# Altium schematic sheet Sheet3.SchDoc
size A4
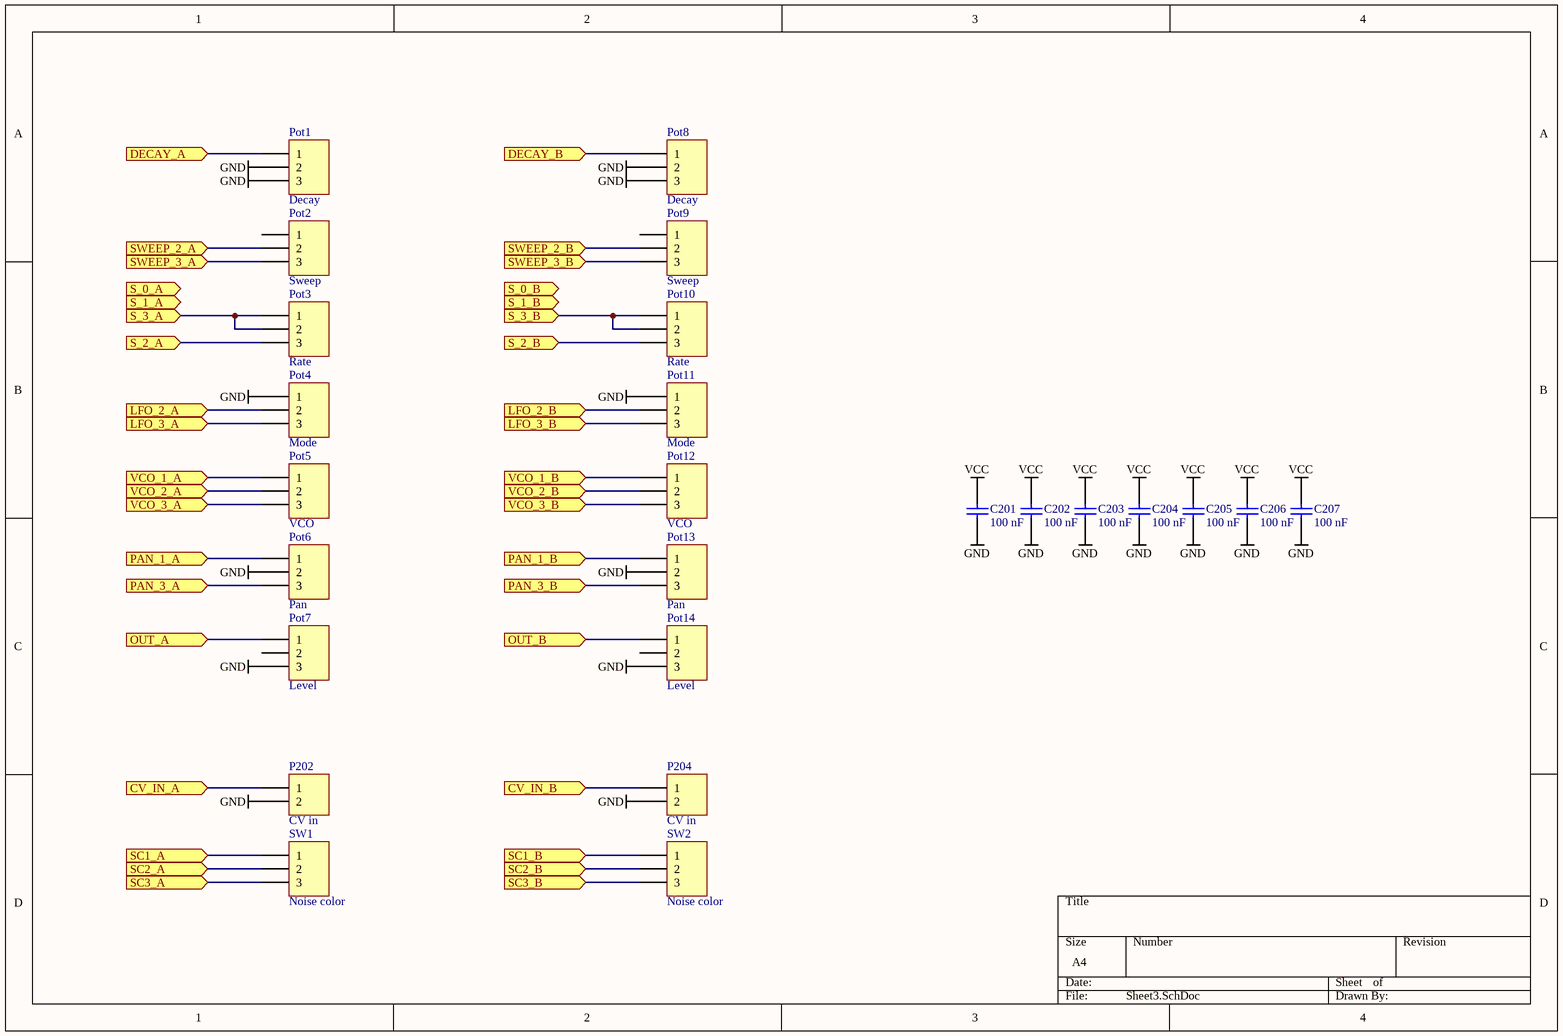
[diagram p0: Sheet3.SchDoc]

## Parts
C201  value 100 nF  [C1206]  (hidden comment: Cap)
C202  value 100 nF  [C1206]  (hidden comment: Cap)
C203  value 100 nF  [C1206]  (hidden comment: Cap)
C204  value 100 nF  [C1206]  (hidden comment: Cap)
C205  value 100 nF  [C1206]  (hidden comment: Cap)
C206  value 100 nF  [C1206]  (hidden comment: Cap)
C207  value 100 nF  [C1206]  (hidden comment: Cap)
P202  CV in  [HDR1X2]
P204  CV in  [HDR1X2]
Pot1  Decay  [HDR1X3]
Pot2  Sweep  [HDR1X3]
Pot3  Rate  [HDR1X3]
Pot4  Mode  [HDR1X3]
Pot5  VCO  [HDR1X3]
Pot6  Pan  [HDR1X3]
Pot7  Level  [HDR1X3]
Pot8  Decay  [HDR1X3]
Pot9  Sweep  [HDR1X3]
Pot10  Rate  [HDR1X3]
Pot11  Mode  [HDR1X3]
Pot12  VCO  [HDR1X3]
Pot13  Pan  [HDR1X3]
Pot14  Level  [HDR1X3]
SW1  Noise color  [HDR1X3]
SW2  Noise color  [HDR1X3]

## Ports
CV_IN_A, CV_IN_B, DECAY_A, DECAY_B, LFO_2_A, LFO_2_B, LFO_3_A, LFO_3_B, OUT_A, OUT_B, PAN_1_A, PAN_1_B, PAN_3_A, PAN_3_B, S_0_A, S_0_B, S_1_A, S_1_B, S_2_A, S_2_B, S_3_A, S_3_B, SC1_A, SC1_B, SC2_A, SC2_B, SC3_A, SC3_B, SWEEP_2_A, SWEEP_2_B, SWEEP_3_A, SWEEP_3_B, VCO_1_A, VCO_1_B, VCO_2_A, VCO_2_B, VCO_3_A, VCO_3_B

## Nets
GND: C201.2 C202.2 C203.2 C204.2 C205.2 C206.2 C207.2 P202.2 P204.2 Pot1.2 Pot1.3 Pot4.1 Pot6.2 Pot7.3 Pot8.2 Pot8.3 Pot11.1 Pot13.2 Pot14.3
VCC: C201.1 C202.1 C203.1 C204.1 C205.1 C206.1 C207.1
CV_IN_A: P202.1 ; port CV_IN_A
CV_IN_B: P204.1 ; port CV_IN_B
DECAY_A: Pot1.1 ; port DECAY_A
DECAY_B: Pot8.1 ; port DECAY_B
LFO_2_A: Pot4.2 ; port LFO_2_A
LFO_2_B: Pot11.2 ; port LFO_2_B
LFO_3_A: Pot4.3 ; port LFO_3_A
LFO_3_B: Pot11.3 ; port LFO_3_B
OUT_A: Pot7.1 ; port OUT_A
OUT_B: Pot14.1 ; port OUT_B
PAN_1_A: Pot6.1 ; port PAN_1_A
PAN_1_B: Pot13.1 ; port PAN_1_B
PAN_3_A: Pot6.3 ; port PAN_3_A
PAN_3_B: Pot13.3 ; port PAN_3_B
S_2_A: Pot3.3 ; port S_2_A
S_2_B: Pot10.3 ; port S_2_B
S_3_A: Pot3.1 Pot3.2 ; port S_3_A
S_3_B: Pot10.1 Pot10.2 ; port S_3_B
SC1_A: SW1.1 ; port SC1_A
SC1_B: SW2.1 ; port SC1_B
SC2_A: SW1.2 ; port SC2_A
SC2_B: SW2.2 ; port SC2_B
SC3_A: SW1.3 ; port SC3_A
SC3_B: SW2.3 ; port SC3_B
SWEEP_2_A: Pot2.2 ; port SWEEP_2_A
SWEEP_2_B: Pot9.2 ; port SWEEP_2_B
SWEEP_3_A: Pot2.3 ; port SWEEP_3_A
SWEEP_3_B: Pot9.3 ; port SWEEP_3_B
VCO_1_A: Pot5.1 ; port VCO_1_A
VCO_1_B: Pot12.1 ; port VCO_1_B
VCO_2_A: Pot5.2 ; port VCO_2_A
VCO_2_B: Pot12.2 ; port VCO_2_B
VCO_3_A: Pot5.3 ; port VCO_3_A
VCO_3_B: Pot12.3 ; port VCO_3_B

Not connected (* = marked no-connect by the designer): Pot2 1; Pot7 2; Pot9 1; Pot14 2

## Library data of the parts
C201-C207 = Cap: Capacitor; Published: 8-Jun-2000; LatestRevisionDate: 17-Jul-2002; LatestRevisionNote: Re-released for DXP Platform.; PackageReference: RAD-0.3; Publisher: Altium Limited; PackageDescription: Radial Cap, Thru-Hole; 2 Leads; 0.3 in Pin Spacing
P202 P204 = Header 2: Header, 2-Pin; LatestRevisionDate: 17-Jul-2002; LatestRevisionNote: Re-released for DXP Platform.; Publisher: Altium Limited
Pot1-Pot14 SW1 SW2 = Header 3: Header, 3-Pin; LatestRevisionDate: 17-Jul-2002; LatestRevisionNote: Re-released for DXP Platform.; Publisher: Altium Limited